# EAGLE design untitled (EAGLE 6.6.0)
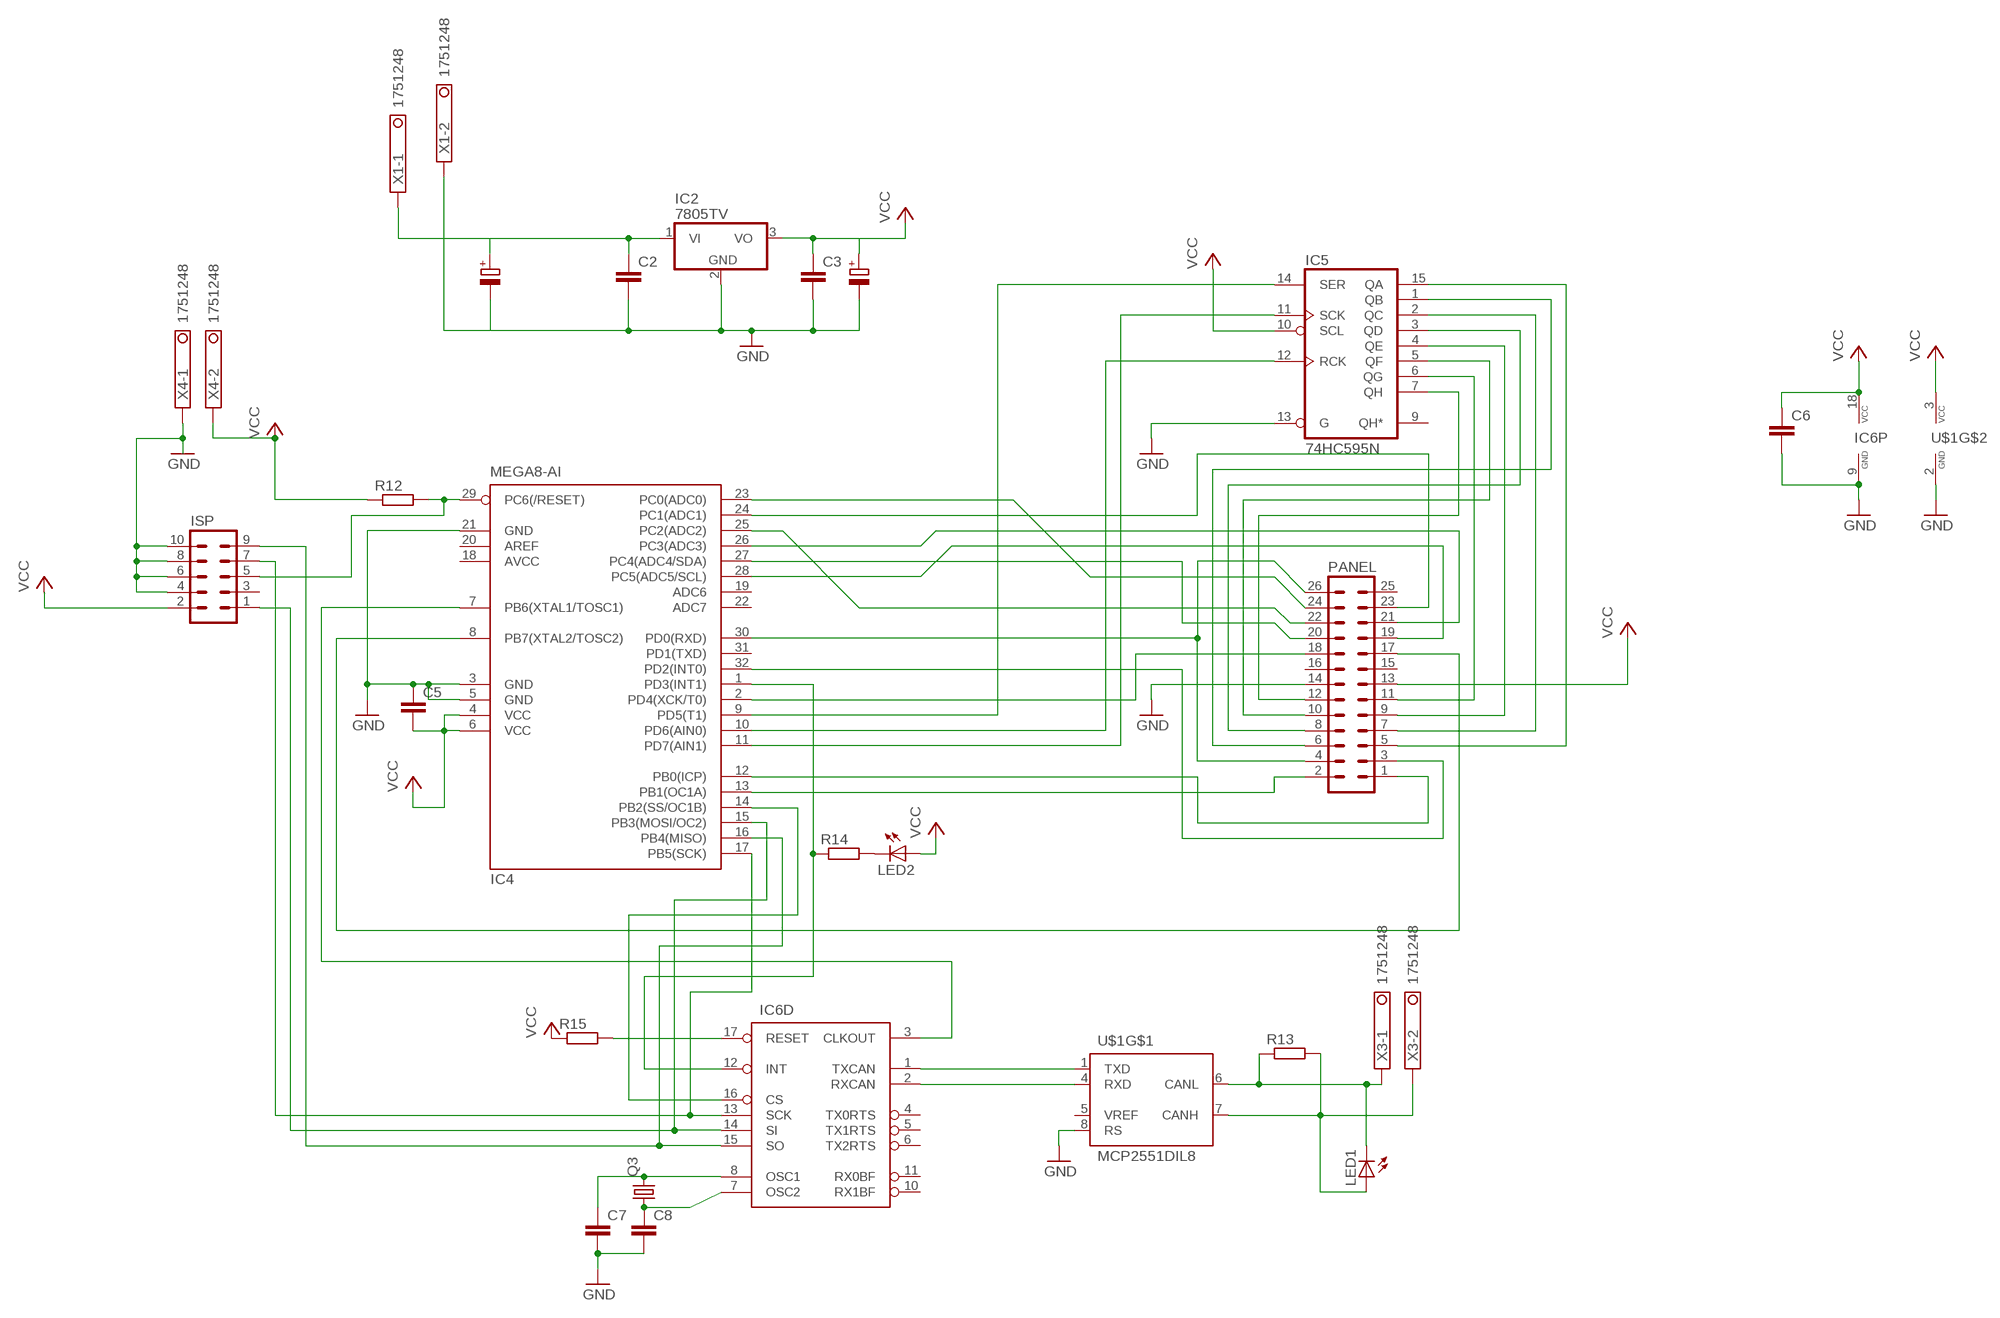
[diagram p0: schematic, sheet 1]

## Parts
C2  C2.5/2  [C2.5-2]
C3  C2.5/2  [C2.5-2]
C5  C2.5/2  [C2.5-2]
C6  C2.5/2  [C2.5-2]
C7  C2.5/2  [C2.5-2]
C8  C2.5/2  [C2.5-2]
IC2  7805TV  [TO220V]
IC4  MEGA8-AI  [TQFP32-08]
IC5  74HC595N  [DIL16]
IC6  MCP2515P  [DIL18]
ISP  ML10  [ML10]
LED1  LED3MM  [LED3MM]
LED2  LED3MM  [LED3MM]
PANEL  ML26  [ML26]
Q3  CRYSTALHC49U-V  [HC49U-V]
R12  R-EU_0207/10  [0207/10]
R13  R-EU_0207/10  [0207/10]
R14  R-EU_0207/10  [0207/10]
R15  R-EU_0207/10  [0207/10]
U$1  MCP2551DIL8  [DIL08]
X1  1751248  [1751248]
X3  1751248  [1751248]
X4  1751248  [1751248]

## Nets
GND: C2.2 C3.2 C5.1 C6.2 C7.2 C8.2 IC2.2(GND) IC4.3(GND) IC4.5(GND) IC4.21(GND) IC5.13(G) IC6.9(P:GND) ISP.4 ISP.6 ISP.8 ISP.10 PANEL.14 U$1.2(GND) U$1.8(RS) X1.2 X4.1
N$5: LED1.K(C) R13.1 U$1.6(CANL) X3.1
N$6: IC4.29(PC6(/RESET)) ISP.5 R12.2
N$7: IC4.12(PB0(ICP)) PANEL.1
N$8: C2.1 IC2.1(VI) X1.1
N$15: IC4.13(PB1(OC1A)) PANEL.2
N$16: IC4.32(PD2(INT0)) PANEL.3
N$18: IC4.30(PD0(RXD)) PANEL.4 PANEL.26
N$19: IC5.15(QA) PANEL.5
N$20: IC5.1(QB) PANEL.6
N$21: IC5.2(QC) PANEL.7
N$22: IC5.3(QD) PANEL.8
N$23: IC5.4(QE) PANEL.9
N$24: IC5.5(QF) PANEL.10
N$25: IC5.6(QG) PANEL.11
N$26: IC5.7(QH) PANEL.12
N$27: LED1.A R13.2 U$1.7(CANH) X3.2
N$28: LED2.K(C) R14.2
N$29: IC4.7(PB6(XTAL1/TOSC1)) IC6.3(D:CLKOUT)
N$30: IC4.8(PB7(XTAL2/TOSC2)) PANEL.17
N$31: IC4.1(PD3(INT1)) IC6.12(D:INT) R14.1
N$32: IC6.1(D:TXCAN) U$1.1(TXD)
N$33: IC6.2(D:RXCAN) U$1.4(RXD)
N$34: C8.1 IC6.7(D:OSC2) Q3.1
N$35: C7.1 IC6.8(D:OSC1) Q3.2
N$36: IC4.23(PC0(ADC0)) PANEL.24
N$37: IC4.14(PB2(SS/OC1B)) IC6.16(D:CS)
N$38: IC6.17(D:RESET) R15.2
N$39: IC4.16(PB4(MISO)) IC6.15(D:SO) ISP.9
N$40: IC4.15(PB3(MOSI/OC2)) IC6.14(D:SI) ISP.1
N$41: IC4.17(PB5(SCK)) IC6.13(D:SCK) ISP.7
N$42: IC4.2(PD4(XCK/T0)) PANEL.18
N$43: IC4.28(PC5(ADC5/SCL)) PANEL.19
N$44: IC4.27(PC4(ADC4/SDA)) PANEL.20
N$45: IC4.26(PC3(ADC3)) PANEL.21
N$46: IC4.25(PC2(ADC2)) PANEL.22
N$47: IC4.24(PC1(ADC1)) PANEL.23
N$49: IC4.11(PD7(AIN1)) IC5.11(SCK)
N$50: IC4.10(PD6(AIN0)) IC5.12(RCK)
N$51: IC4.9(PD5(T1)) IC5.14(SER)
VCC: C3.1 C5.2 C6.1 IC2.3(VO) IC4.4(VCC) IC4.6(VCC) IC5.10(SCL) IC6.18(P:VCC) ISP.2 LED2.A PANEL.13 R12.1 R15.1 U$1.3(VCC) X4.2
Unconnected: IC4.19(ADC6) IC4.20(AREF) IC4.22(ADC7) IC4.31(PD1(TXD)) IC5.9(QH*) IC6.4(D:TX0RTS) IC6.5(D:TX1RTS) IC6.6(D:TX2RTS) IC6.10(D:RX1BF) IC6.11(D:RX0BF) ISP.3 PANEL.15 PANEL.16 PANEL.25 U$1.5(VREF)

## Power pins joined to a net without a drawn wire
AVCC: IC4.18(AVCC)
GND: IC5.8(GND)
VCC: IC5.16(VCC)

## Library data of the parts
C2 C3 C5-C8 = capacitor-wima:C: CAPACITOR naming: grid - package width
IC2 = linear:78*: Positive VOLTAGE REGULATOR Source: http://cache.national.com/ds/LM/LM78L05.pdf http://www.fairchildsemi.com/ds/LM/LM7805.pdf
IC4 = atmel:MEGA8: MICROCONTROLLER 8 Kbytes FLASH, 1 kbytes SRAM, 512 bytes EEPROM, USART, 6-channel 10 bit ADC, 2-channel 8 bit ADC Pin compatible with Atmega48, ATMega88, ATMega168 Source: avr.lbr; MPN: ATMEGA8-16AU; OC_FARNELL: 9171371; OC_NEWARK: 73M8863
IC5 = 74xx-eu:74*595: 8-bit SHIFT REGISTER, output latch
IC6 = can:MCP2515: MC2515 Stand-Alone CAN Controller With SPI Interface, Microchip
ISP = con-ml:ML10: HARTING; OC_FARNELL: unknown; OC_NEWARK: unknown
LED1 LED2 = led:LED: LED OSRAM: - CHIPLED LG R971, LG N971, LY N971, LG Q971, LY Q971, LO R971, LY R971 LH N974, LH R974 LS Q976, LO Q976, LY Q976 LO Q996 - Hyper CHIPLED LW Q18S LB Q993, LB Q99A, LB R99A - SideLED LS A670, LO A670, LY A670, LG A670, LP A670 LB A673, LV A673, LT A673, LW A673 LH A674 LY A675 LS A676, LA A676, LO A676, LY A676, LW A676 LS A679, LY A679, LG A679 - Hyper Micro SIDELED® LS Y876, LA Y876, LO Y876, LY Y876 LT Y87S - SmartLED LW L88C, LW L88S LB L89C, LB L89S, LG L890 LS L89K, LO L89K, LY L89K LS L896, LA L896, LO L896, LY L896 - TOPLED LS T670, LO T670, LY T670, LG T670, LP T670 LSG T670, LSP T670, LSY T670, LOP T670, LYG T670 LG T671, LOG T671, LSG T671 LB T673, LV T673, LT T673, LW T673 LH T674 LS T676, LA T676, LO T676, LY T676, LB T676, LH T676, LSB T676, LW T676 LB T67C, LV T67C, LT T67C, LS T67K, LO T67K, LY T67K, LW E67C LS E67B, LA E67B, LO E67B, LY E67B, LB E67C, LV E67C, LT E67C LW T67C LS T679, LY T679, LG T679 LS T770, LO T770, LY T770, LG T770, LP T770 LB T773, LV T773, LT T773, LW T773 LH T774 LS E675, LA E675, LY E675, LS T675 LS T776, LA T776, LO T776, LY T776, LB T776 LHGB T686 LT T68C, LB T68C - Hyper Mini TOPLED® LB M676 - Mini TOPLED Santana® LG M470 LS M47K, LO M47K, LY M47K Source: http://www.osram.convergy.de LUXEON: - LUMILED® LXK2-PW12-R00, LXK2-PW12-S00, LXK2-PW14-U00, LXK2-PW14-V00 LXK2-PM12-R00, LXK2-PM12-S00, LXK2-PM14-U00 LXK2-PE12-Q00, LXK2-PE12-R00, LXK2-PE12-S00, LXK2-PE14-T00, LXK2-PE14-U00 LXK2-PB12-K00, LXK2-PB12-L00, LXK2-PB12-M00, LXK2-PB14-N00, LXK2-PB14-P00, LXK2-PB14-Q00 LXK2-PR12-L00, LXK2-PR12-M00, LXK2-PR14-Q00, LXK2-PR14-R00 LXK2-PD12-Q00, LXK2-PD12-R00, LXK2-PD12-S00 LXK2-PH12-R00, LXK2-PH12-S00 LXK2-PL12-P00, LXK2-PL12-Q00, LXK2-PL12-R00 Source: www.luxeon.com KINGBRIGHT: KA-3528ASYC Source: www.kingbright.com
PANEL = con-ml:ML26: HARTING; OC_FARNELL: unknown; OC_NEWARK: unknown
Q3 = crystal:CRYSTAL: CRYSTAL; OC_FARNELL: 1666969; OC_NEWARK: unknown
R12-R15 = rcl:R-EU_: RESISTOR, European symbol
U$1 = can:MCP2551: CAN Tranceiver Microchip
X1 X3 X4 = con-phoenix-350:1751248: MKDS 1/ 2-3,5 Printklemme Nennstrom: 10 A Bemessungsspannung: 160 V Raster: 3,5 mm Polzahl: 2 Montageart: Löten Anschlussart: Schraubanschluss Anschlussrichtung vom Leiter zur Platine: 0° Source: http://eshop.phoenixcontact.com .. 1751248.pdf; OC_FARNELL: unknown; OC_NEWARK: unknown

## Board
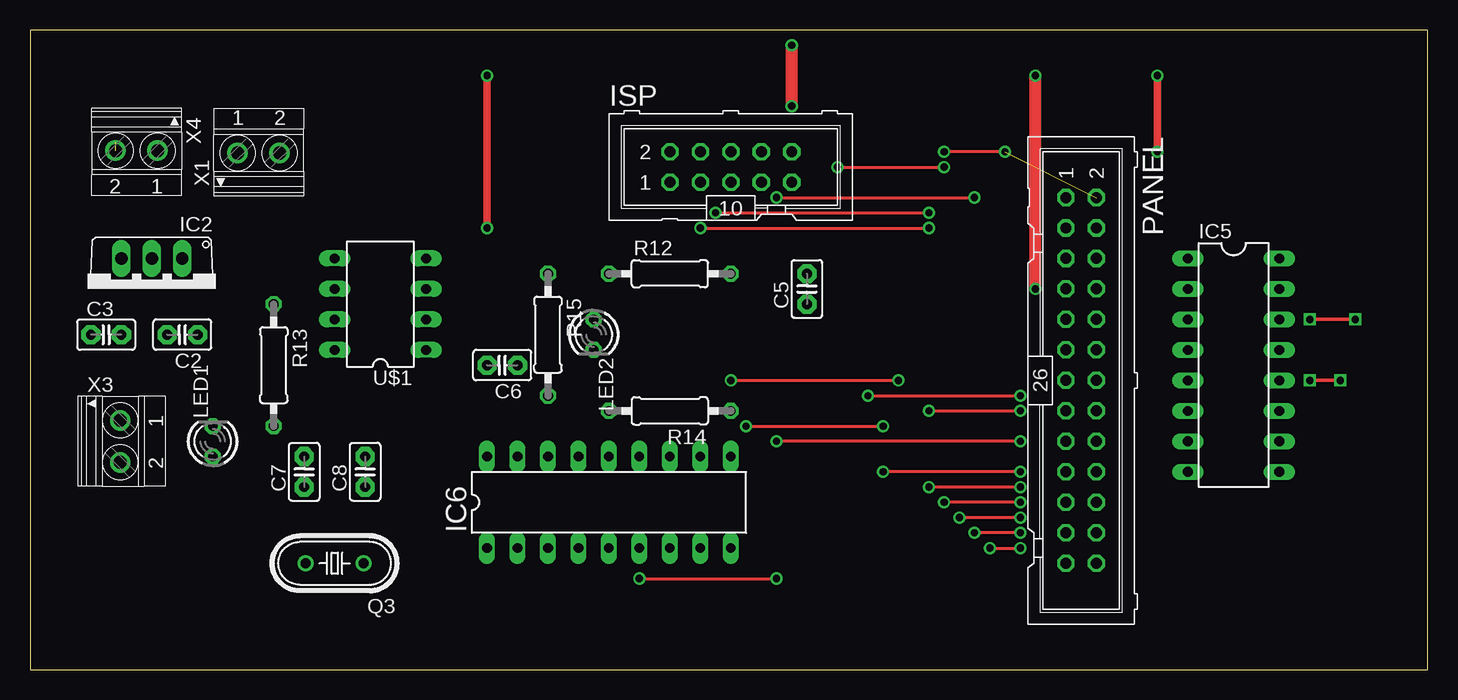
[diagram p1: board, top side]
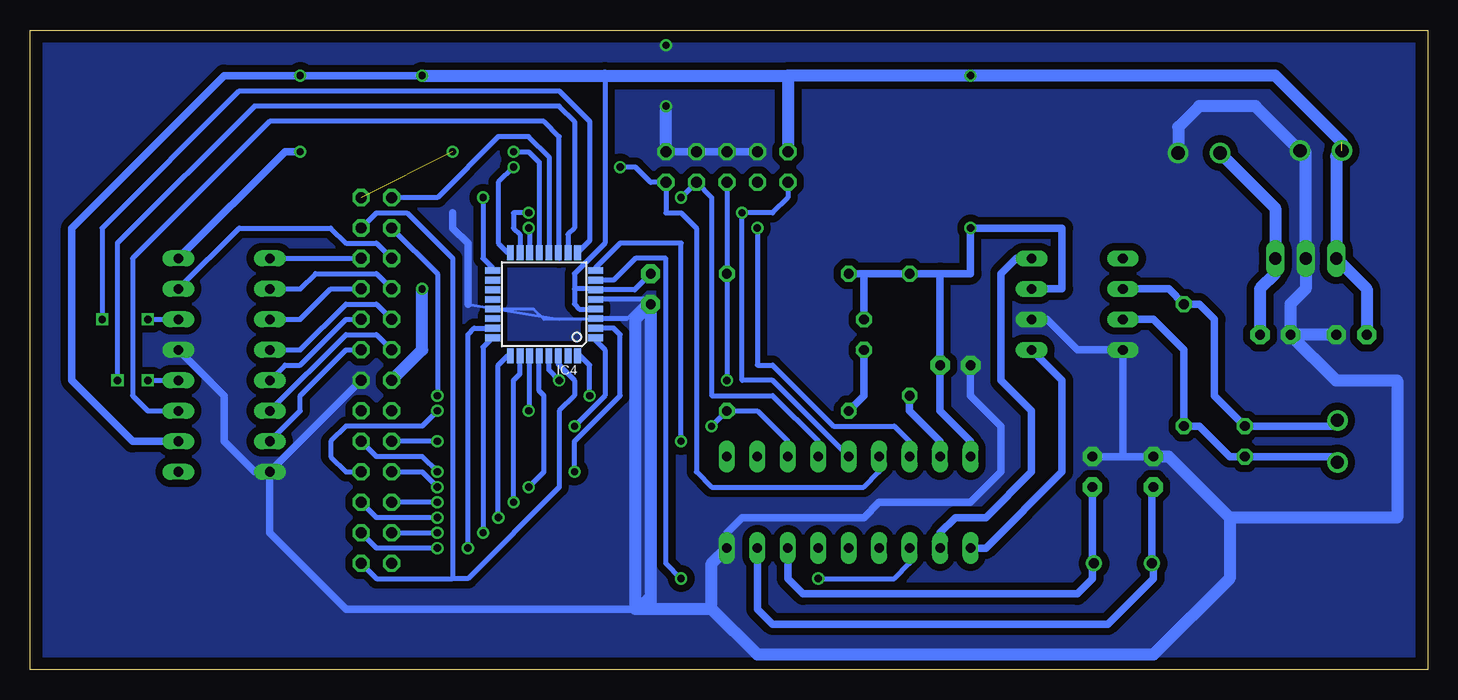
[diagram p2: board, bottom side, seen from below]

Size 116.51 x 53.33 mm. Coordinates in mm from the lower left corner, seen from the top.
Outline: 0,0 116.51,0 116.51,53.33 0,53.33 0,0
Copper layers (1*16): Top 0.035mm / dielectric 1.5mm / Bottom 0.035mm
Design rules "default": minimum track width 10mil, minimum drill 24mil, track to track 8mil, track to pad 8mil, pad to pad 8mil, via to via 8mil, smd to smd 8mil, copper to edge 40mil, drill to drill 8mil, minimum pad ring 10mil, minimum via ring 8mil, stop-mask expansion 4mil, vias tented up to drill 0mil, thermal gap 10mil

### Footprints (pad centres in the part's own frame; a part is rotated, then mirrored left to right if it is on the bottom)
C2.5-2 = drill 0.813 pad 1.6 octagon: 1 -1.27,0; 2 1.27,0
TO220V = drill 1.016 long: 1 -2.54,-2.54; 2 0,-2.54; 3 2.54,-2.54
TQFP32-08 = smd 1.27 x 0.559: 1 -4.293,2.8; 2 -4.293,2; 3 -4.293,1.2; 4 -4.293,0.4; 5 -4.293,-0.4; 6 -4.293,-1.2; 7 -4.293,-2; 8 -4.293,-2.8; 17 4.293,-2.8; 18 4.293,-2; 19 4.293,-1.2; 20 4.293,-0.4; 21 4.293,0.4; 22 4.293,1.2; 23 4.293,2; 24 4.293,2.8 | smd 0.559 x 1.27: 9 -2.8,-4.293; 10 -2,-4.293; 11 -1.2,-4.293; 12 -0.4,-4.293; 13 0.4,-4.293; 14 1.2,-4.293; 15 2,-4.293; 16 2.8,-4.293; 25 2.8,4.293; 26 2,4.293; 27 1.2,4.293; 28 0.4,4.293; 29 -0.4,4.293; 30 -1.2,4.293; 31 -2,4.293; 32 -2.8,4.293
DIL16 = drill 0.813 long: 1 -8.89,-3.81; 2 -6.35,-3.81; 3 -3.81,-3.81; 4 -1.27,-3.81; 5 1.27,-3.81; 6 3.81,-3.81; 7 6.35,-3.81; 8 8.89,-3.81; 9 8.89,3.81; 10 6.35,3.81; 11 3.81,3.81; 12 1.27,3.81; 13 -1.27,3.81; 14 -3.81,3.81; 15 -6.35,3.81; 16 -8.89,3.81
DIL18 = drill 0.813 long: 1 -10.16,-3.81; 2 -7.62,-3.81; 3 -5.08,-3.81; 4 -2.54,-3.81; 5 0,-3.81; 6 2.54,-3.81; 7 5.08,-3.81; 8 7.62,-3.81; 9 10.16,-3.81; 10 10.16,3.81; 11 7.62,3.81; 12 5.08,3.81; 13 2.54,3.81; 14 0,3.81; 15 -2.54,3.81; 16 -5.08,3.81; 17 -7.62,3.81; 18 -10.16,3.81
ML10 = drill 0.914 octagon: 1 -5.08,-1.27; 2 -5.08,1.27; 3 -2.54,-1.27; 4 -2.54,1.27; 5 0,-1.27; 6 0,1.27; 7 2.54,-1.27; 8 2.54,1.27; 9 5.08,-1.27; 10 5.08,1.27
LED3MM = drill 0.813 octagon: A -1.27,0; K 1.27,0
ML26 = drill 0.914 octagon: 1 -15.24,-1.27; 2 -15.24,1.27; 3 -12.7,-1.27; 4 -12.7,1.27; 5 -10.16,-1.27; 6 -10.16,1.27; 7 -7.62,-1.27; 8 -7.62,1.27; 9 -5.08,-1.27; 10 -5.08,1.27; 11 -2.54,-1.27; 12 -2.54,1.27; 13 0,-1.27; 14 0,1.27; 15 2.54,-1.27; 16 2.54,1.27; 17 5.08,-1.27; 18 5.08,1.27; 19 7.62,-1.27; 20 7.62,1.27; 21 10.16,-1.27; 22 10.16,1.27; 23 12.7,-1.27; 24 12.7,1.27; 25 15.24,-1.27; 26 15.24,1.27
HC49U-V = drill 0.813: 1 -2.413,0; 2 2.413,0
0207/10 = drill 0.813 octagon: 1 -5.08,0; 2 5.08,0
DIL08 = drill 0.813 long: 1 -3.81,-3.81; 2 -1.27,-3.81; 3 1.27,-3.81; 4 3.81,-3.81; 5 3.81,3.81; 6 1.27,3.81; 7 -1.27,3.81; 8 -3.81,3.81
1751248 = drill 1.1 pad 1.7: 1 -1.75,-0.1; 2 1.75,-0.1

### Placement (x,y rotation side)
C2  12.7,27.94 180 top
C3  6.35,27.94 0 top
C5  64.77,31.75 90 top
C6  39.37,25.4 180 top
C7  22.86,16.51 90 top
C8  27.94,16.51 90 top
IC2  10.16,31.75 180 top
IC4  73.66,30.48 180 bottom
IC5  100.33,25.4 270 top
IC6  48.26,13.97 0 top
ISP  58.42,41.91 0 top
LED1  15.24,19.05 90 top
LED2  46.99,27.94 270 top
PANEL  87.63,24.13 270 top
Q3  25.4,8.89 180 top
R12  53.34,33.02 0 top
R13  20.32,25.4 270 top
R14  53.34,21.59 180 top
R15  43.18,27.94 270 top
U$1  29.21,30.48 90 top
X1  19.05,43.18 0 top
X3  7.62,19.05 270 top
X4  8.89,43.18 180 top

### Tracks (layer width: path | path; a pad name or v marks a point on that pad's centre or on a via)
GND  (via drill 0.6)
  Top 1.016: v63.5,46.99 v63.5,52.07
  Bottom 0.254: IC4.3 69.44,29.21 72.39,29.21 | 72.39,29.21 73.66,29.21 74.53,30.08 IC4.21 | C5.1 65.17,30.88 66.77,29.28 | 80.01,30.48 72.39,29.21
  Bottom 0.406: 65.17,30.88 IC4.5 | 66.77,29.28 IC4.3
  Bottom 0.61: IC5.8 96.52,11.43 90.17,5.08 66.04,5.08 64.77,6.35 C5.1 | IC5.13 100.33,22.86 100.33,19.05 97.79,16.51 IC5.8 | IC5.8 PANEL.14 | ISP.10 ISP.4 | U$1.2 31.75,29.21 29.21,26.67 U$1.8 25.4,17.78 | C6.2 38.1,22.86 35.56,20.32 35.56,16.51 38.1,13.97 45.72,13.97 46.99,12.7 57.15,12.7 58.42,11.43 IC6.9 | C8.2 25.4,17.78 | 25.4,17.78 C7.2 | 81.28,38.1 81.28,36.83 80.01,35.56 80.01,30.48
  Bottom 1.016: C3.2 C2.2 | X1.2 20.8,45.24 19.05,46.99 14.35,46.99 X4.1 10.26,43.28 10.16,43.18 IC2.2 10.16,31.75 11.43,30.48 C2.2 | C2.2 7.62,24.13 2.54,24.13 2.54,12.7 16.51,12.7 | 16.51,12.7 21.59,17.78 C7.2 | 16.51,12.7 16.51,7.62 22.86,1.27 55.88,1.27 59.69,5.08 | 59.69,5.08 59.69,8.89 IC6.9 | 59.69,5.08 64.77,5.08 | 64.77,5.08 66.04,5.08 66.04,29.21 C5.1 64.77,5.08 | ISP.10 v63.5,46.99
  pour Bottom (isolate 0.61, no thermals): 0,52.07 0,0 114.3,0 114.3,52.07
  pour Bottom (isolate 0.61, no thermals): 0,53.34 0,0 116.84,0 116.84,53.34
N$5
  Bottom 0.254: 7.62,20.32 X3.1
  Bottom 0.61: 7.62,20.32 LED1.K 17.78,22.86 17.78,29.21 19.05,30.48 R13.1 21.59,31.75 U$1.6
N$6  (via drill 0.6)
  Top 0.254: v58.42,24.13 v72.39,24.13
  Bottom 0.406: v72.39,24.13 73.26,25 IC4.29 | ISP.5 R12.2 v58.42,24.13
N$7
  Bottom 0.406: IC4.12 73.26,42.78 74.93,44.45 77.47,44.45 82.55,39.37 PANEL.1
N$8
  Bottom 1.016: X1.1 12.7,38.48 IC2.1 12.7,33.02 13.97,31.75 C2.1
N$15  (via drill 0.6)  (1 unrouted)
  Top 0.254: v81.28,43.18 v76.2,43.18
  Bottom 0.406: v76.2,43.18 74.93,43.18 74.06,42.31 IC4.13
N$16  (via drill 0.6)
  Top 0.254: v69.85,22.86 v82.55,22.86
  Bottom 0.406: PANEL.3 82.55,33.02 v82.55,22.86 | v69.85,22.86 69.85,25.4 70.64,26.19 IC4.32
N$18
  Bottom 0.254: 72.39,26.67 IC4.30 72.46,25.47
  Bottom 0.406: PANEL.4 87.63,38.1 85.09,38.1 81.28,34.29 81.28,7.62 | PANEL.26 87.63,7.62 81.28,7.62 | 72.46,25.47 71.12,24.13 71.12,22.86 72.39,21.59 72.39,15.24 80.01,7.62 81.28,7.62
N$19
  Bottom 0.406: IC5.15 99.06,36.83 91.44,36.83 90.17,35.56 87.63,35.56 PANEL.5
N$20
  Bottom 0.406: IC5.1 PANEL.6
N$21
  Bottom 0.406: IC5.2 93.98,31.75 92.71,33.02 87.63,33.02 PANEL.7
N$22
  Bottom 0.406: IC5.3 93.98,29.21 91.44,31.75 PANEL.8
N$23
  Bottom 0.406: IC5.4 93.98,26.67 90.17,30.48 87.63,30.48 PANEL.9
N$24
  Bottom 0.406: IC5.5 95.25,25.4 93.98,25.4 90.17,29.21 PANEL.10
N$25
  Bottom 0.406: IC5.6 90.17,27.94 87.63,27.94 PANEL.11
N$26
  Bottom 0.406: IC5.7 93.98,21.59 93.98,22.86 90.17,26.67 PANEL.12
N$27
  Bottom 0.61: X3.2 8,17.78 LED1.A 16.51,17.78 19.05,20.32 R13.2 20.32,26.67 22.86,29.21 U$1.7
N$28
  Bottom 0.61: LED2.K 46.99,22.86 R14.2
N$29  (via drill 0.6)
  Top 0.254: v50.8,7.62 v62.23,7.62
  Bottom 0.406: v50.8,7.62 44.45,7.62 43.18,8.89 IC6.3 | v62.23,7.62 63.5,8.89 63.5,34.29 66.04,34.29 67.85,32.48 IC4.7
N$30  (via drill 0.6)
  Top 0.254: v82.55,19.05 v62.23,19.05
  Bottom 0.406: v82.55,19.05 PANEL.17 | v62.23,19.05 62.23,35.56 67.31,35.56 69.37,33.5 IC4.8
N$31  (via drill 0.6)
  Top 0.254: v59.69,20.32 v71.12,20.32
  Bottom 0.254: 69.37,27.46 IC4.1
  Bottom 0.406: 69.37,27.46 68.58,26.67 68.58,22.86 v71.12,20.32 | IC6.12 53.34,19.05 55.88,21.59 R14.1 v59.69,20.32
N$32
  Bottom 0.254: 33.02,13.97 36.83,10.16
  Bottom 0.61: U$1.1 30.48,24.13 30.48,16.51 36.83,10.16 IC6.1
N$33
  Bottom 0.61: U$1.4 34.29,34.29 35.56,33.02 35.56,24.13 33.02,21.59 33.02,16.51 36.83,12.7 39.37,12.7 40.64,11.43 IC6.2
N$34
  Bottom 0.61: IC6.7 53.34,7.62 52.07,6.35 29.21,6.35 27.94,7.62 27.94,8.76 Q3.1 27.94,9.02 C8.1
N$35
  Bottom 0.61: C7.1 22.99,15.11 Q3.2 22.86,8.76 22.86,7.62 26.67,3.81 54.61,3.81 55.88,5.08 IC6.8
N$36  (via drill 0.6)
  Top 0.254: v80.01,10.16 v82.55,10.16
  Bottom 0.406: v82.55,10.16 87.63,10.16 PANEL.24 | v80.01,10.16 80.01,27.94 79.47,28.48 IC4.23
N$37  (via drill 0.6)
  Top 0.254: v55.88,36.83 v74.93,36.83
  Bottom 0.254: v74.93,36.83 74.86,36.76
  Bottom 0.406: 74.86,36.76 IC4.14 | v55.88,36.83 55.88,25.4 54.61,25.4 49.53,20.32 44.45,20.32 43.18,19.05 IC6.16
N$38
  Bottom 0.61: R15.2 43.18,21.59 40.64,19.05 IC6.17
N$39  (via drill 0.6)
  Top 0.254: v67.31,41.91 v76.2,41.91
  Bottom 0.406: v76.2,41.91 77.47,40.64 77.47,35.56 76.68,34.77 IC4.16 | v67.31,41.91 66.04,41.91 64.77,40.64 ISP.9 63.5,38.1 62.23,38.1 60.96,36.83 60.96,16.51 59.69,15.24 46.99,15.24 45.72,16.51 IC6.15
N$40  (via drill 0.6)
  Top 0.254: v57.15,38.1 v74.93,38.1
  Bottom 0.406: v74.93,38.1 76.2,38.1 76.2,36.83 75.66,36.29 IC4.15 | ISP.1 53.34,39.37 54.61,38.1 v57.15,38.1 57.15,24.13 54.61,24.13 IC6.14
N$41  (via drill 0.6)
  Top 0.254: v62.23,39.37 v78.74,39.37
  Bottom 0.406: v78.74,39.37 78.74,34.29 77.95,33.5 IC4.17 | v62.23,39.37 ISP.7 59.69,39.37 59.69,22.86 54.61,22.86 50.8,19.05 IC6.13
N$42  (via drill 0.6)
  Top 0.254: v82.55,16.51 v71.12,16.51
  Bottom 0.406: v82.55,16.51 83.82,17.78 87.63,17.78 PANEL.18 | v71.12,16.51 71.12,19.05 67.31,22.86 67.31,27.94 67.85,28.48 IC4.2
N$43  (via drill 0.6)
  Top 0.254: v82.55,15.24 v74.93,15.24
  Bottom 0.406: PANEL.19 83.82,16.51 v82.55,15.24 | v74.93,15.24 73.66,16.51 73.66,22.86 74.06,23.26 IC4.28
N$44  (via drill 0.6)
  Top 0.254: v74.93,21.59 v82.55,21.59
  Bottom 0.254: 74.93,26.67 IC4.27
  Bottom 0.406: v82.55,21.59 83.82,20.32 90.17,20.32 91.44,19.05 91.44,17.78 90.17,16.51 PANEL.20 | v74.93,21.59 74.86,21.66 IC4.27
N$45  (via drill 0.6)
  Top 0.254: v82.55,13.97 v76.2,13.97
  Bottom 0.406: v82.55,13.97 PANEL.21 | v76.2,13.97 76.2,24.13 75.66,24.67 IC4.26
N$46  (via drill 0.6)
  Top 0.254: v82.55,12.7 v77.47,12.7
  Bottom 0.406: v82.55,12.7 87.63,12.7 PANEL.22 | v77.47,12.7 77.47,25.4 76.68,26.19 IC4.25
N$47  (via drill 0.6)
  Top 0.254: v82.55,11.43 v78.74,11.43
  Bottom 0.406: PANEL.23 v82.55,11.43 | IC4.24 78.74,26.89 v78.74,11.43
N$49
  Bottom 0.254: 72.39,34.29 IC4.11
  Bottom 0.406: 72.39,34.29 72.39,44.45 73.66,45.72 96.52,45.72 107.95,34.29 107.95,22.86 106.68,21.59 IC5.11
N$50  (via drill 0.6)
  Top 0.305: v109.22,24.13 v106.68,24.13
  Bottom 0.406: IC4.10 71.66,36.29 71.12,36.83 71.12,45.72 72.39,46.99 97.79,46.99 109.22,35.56 v109.22,24.13 | v106.68,24.13 IC5.12
N$51  (via drill 0.6)
  Top 0.305: v106.68,29.21 v110.49,29.21
  Bottom 0.406: IC4.9 69.85,35.78 69.85,45.72 72.39,48.26 99.06,48.26 110.49,36.83 v110.49,29.21 | v106.68,29.21 IC5.14
VCC  (via drill 0.6)  (1 unrouted)
  Top 0.61: v93.98,43.18 v93.98,49.53 | v38.1,36.83 v38.1,49.53
  Top 1.016: v83.82,31.75 v83.82,49.53
  Bottom 0.406: 68.58,49.53 68.58,35.56 71.12,33.02 71.12,31.75 | 71.12,31.75 71.12,30.48 70.72,30.08 IC4.4 | 71.12,31.75 69.44,31.75 IC4.6 66.11,31.68 C5.2
  Bottom 0.61: U$1.3 30.48,31.75 30.48,36.83 v38.1,36.83 38.1,33.02 40.64,33.02 | IC5.10 107.95,19.05 113.03,24.13 113.03,36.83 100.33,49.53 v93.98,49.53 v83.82,49.53 | 40.64,33.02 R15.1 46.99,33.02 | 46.99,33.02 R12.1 | 40.64,33.02 C6.1 40.64,21.59 38.1,19.05 IC6.18 | IC5.16 95.25,43.18 v93.98,43.18 | LED2.A 46.99,33.02
  Bottom 1.016: PANEL.13 83.82,26.67 v83.82,31.75 | v83.82,49.53 68.58,49.53 53.34,49.53 | 53.34,49.53 ISP.2 | 7.14,43.97 12.7,49.53 v38.1,49.53 53.34,49.53 | X4.2 7.62,42.8 IC2.3 5.08,31.75 C3.1